# EasyEDA schematic EasyEDA_source_schematic.json
TITLE: Gluon Polarizer; REV: 1.0; Date: 2019-03-26; Sheet: 1/1; Drawn By: legomaster616; Company: Open-VX
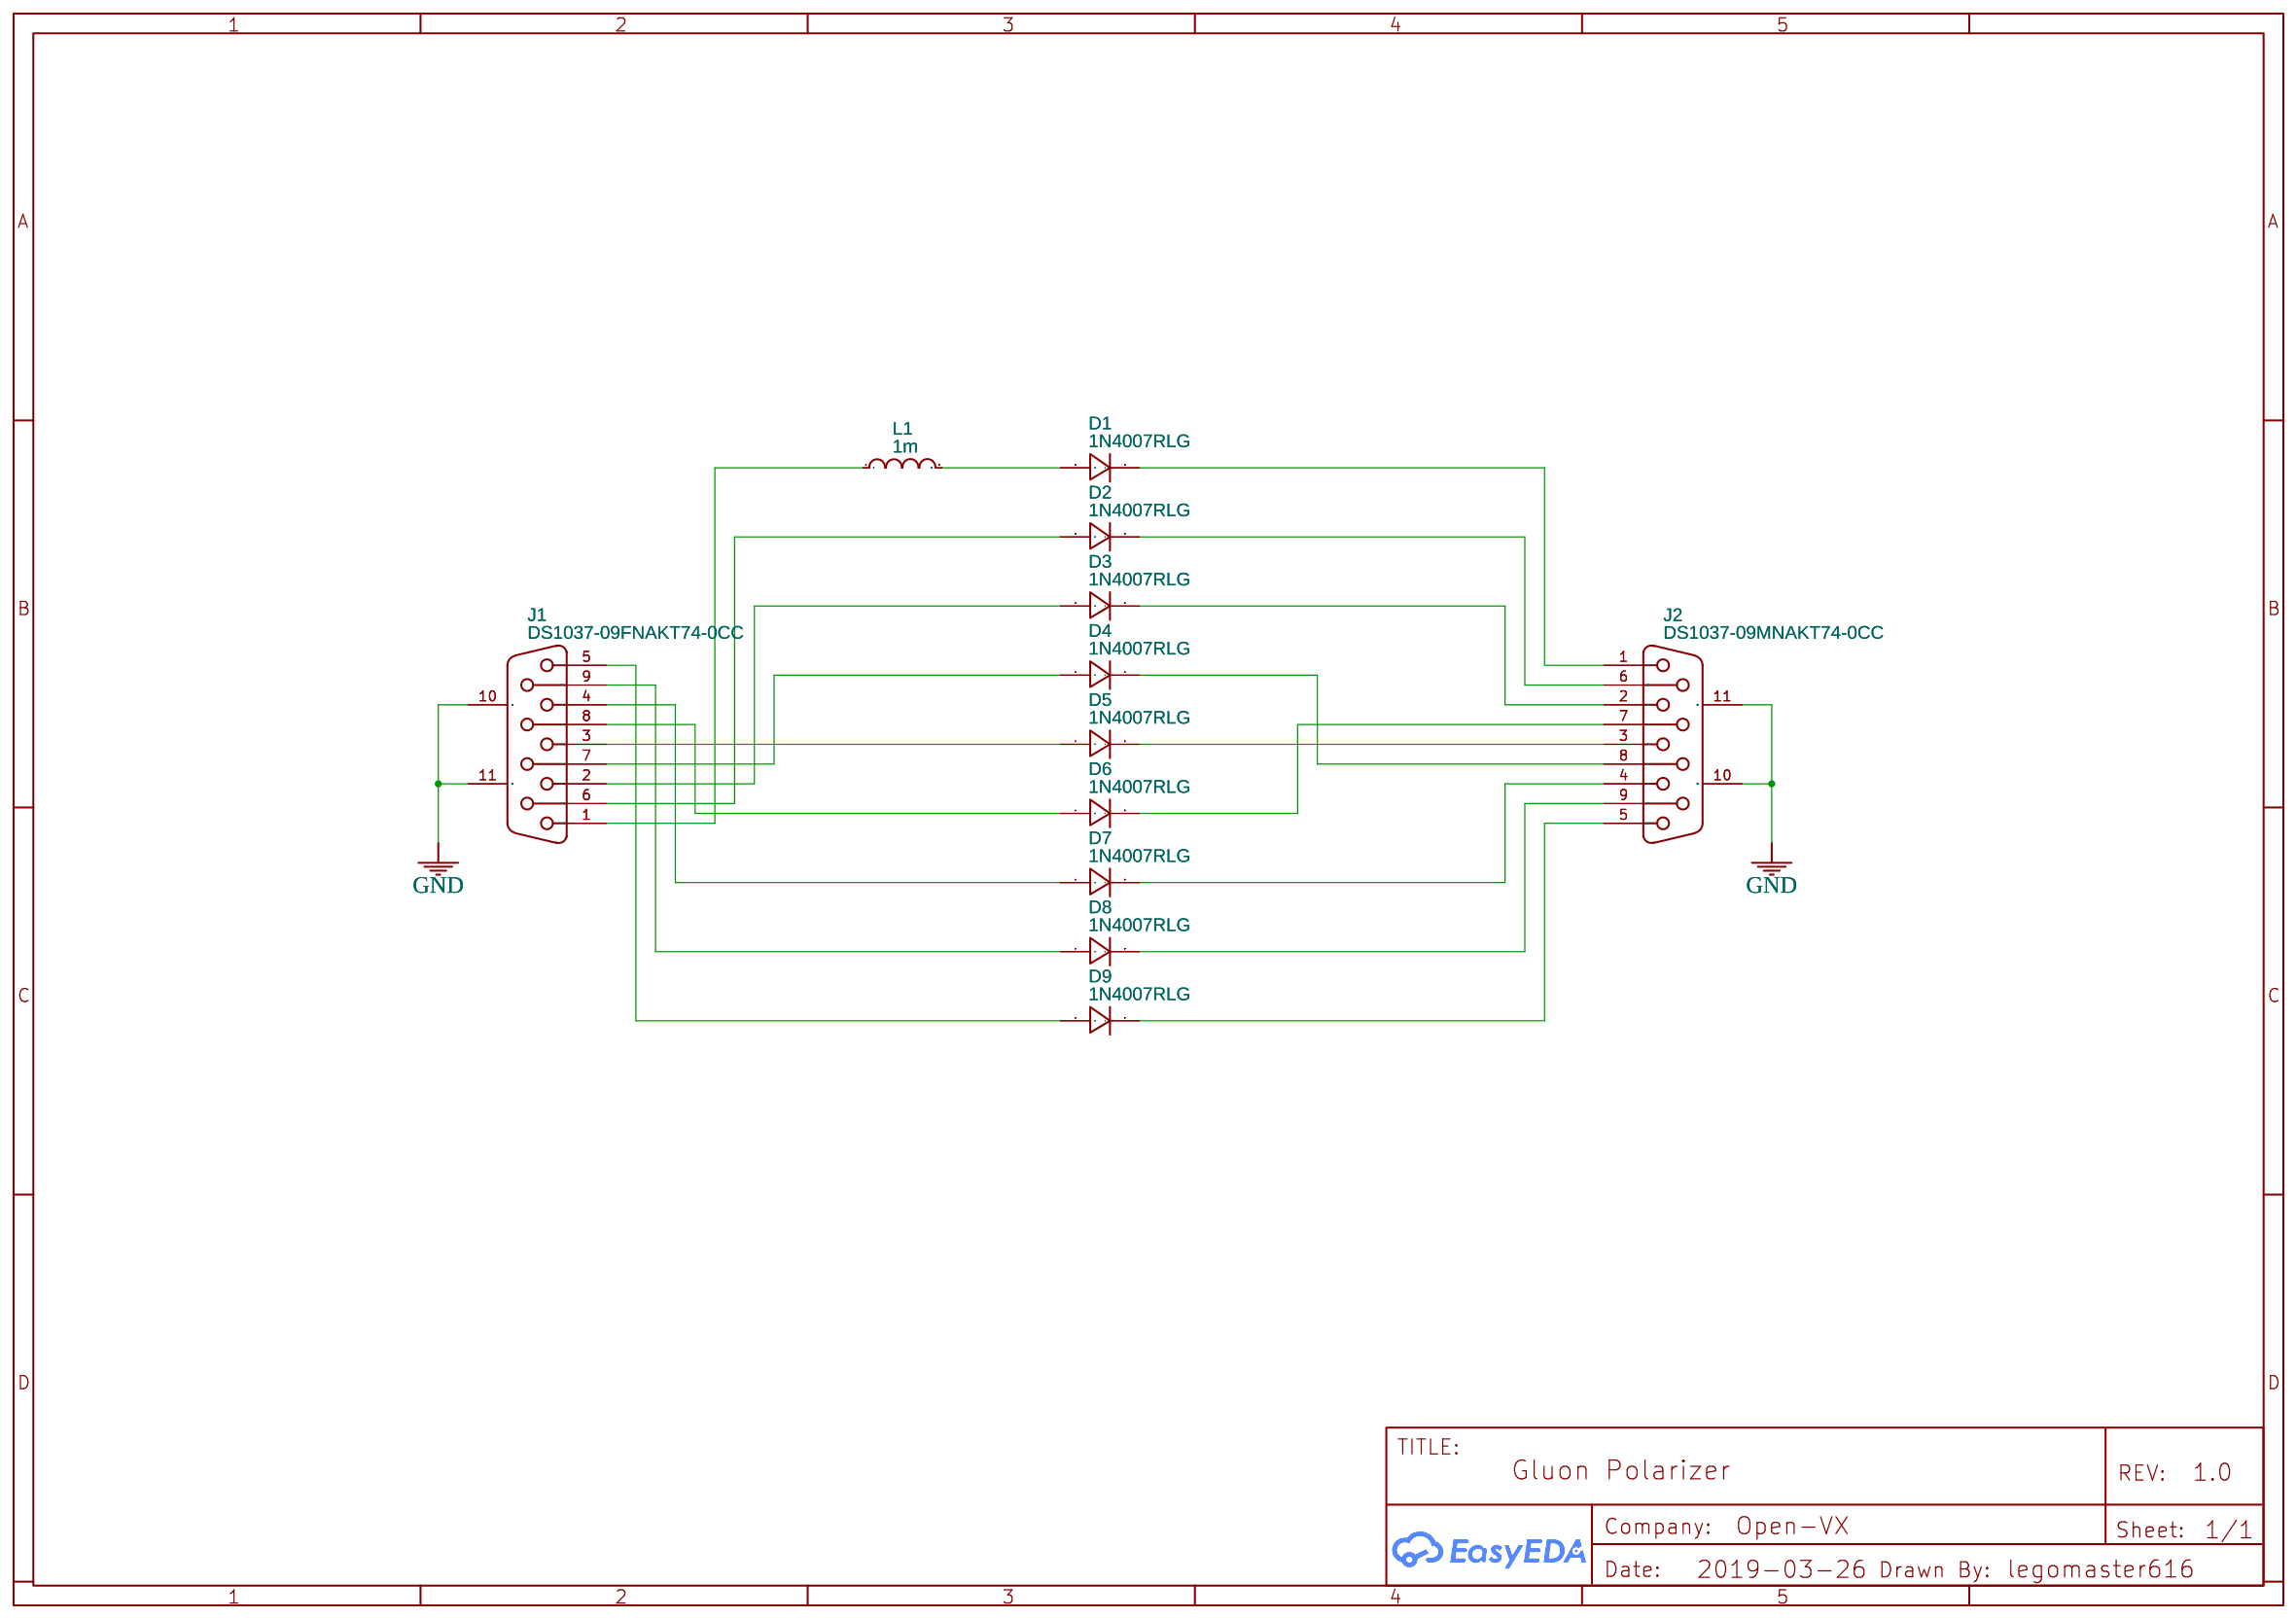
[diagram p0: schematic sheet]

## Parts
D1  1N4007RLG  [DO-41]
D2  1N4007RLG  [DO-41]
D3  1N4007RLG  [DO-41]
D4  1N4007RLG  [DO-41]
D5  1N4007RLG  [DO-41]
D6  1N4007RLG  [DO-41]
D7  1N4007RLG  [DO-41]
D8  1N4007RLG  [DO-41]
D9  1N4007RLG  [DO-41]
J1  DS1037-09FNAKT74-0CC  [DSUB9-1]
J2  DS1037-09MNAKT74-0CC  [DSUB9-1]
L1  1m  [AXIAL-0.4]

## Library data of the parts
D1-D9 = -: Supplier: LCSC; Manufacturer: ON; image: //image.lceda.cn/szlcsc/C53568.jpg; Supplier Part: C53568
J1 = -: Supplier: LCSC; Manufacturer: CONNFLY; image: //image.lceda.cn/szlcsc/C75749.jpg; Supplier Part: C75749
J2 = -: Supplier: LCSC; Manufacturer: CONNFLY; image: //image.lceda.cn/szlcsc/C75750.jpg; Supplier Part: C75750
L1 = Inductor_AXIAL-0.4_US: Manufacturer Part: ?

## Nets
GND: J1.10(MH1) J1.11(MH2) J2.10(MH1) J2.11(MH2)
D1_1: D1.1(+) L1.2
D1_2: D1.2(-) J2.1
D2_1: D2.1(+) J1.6
D2_2: D2.2(-) J2.6
D3_1: D3.1(+) J1.2
D3_2: D3.2(-) J2.2
D4_1: D4.1(+) J1.7
D4_2: D4.2(-) J2.8
D5_1: D5.1(+) J1.3
D5_2: D5.2(-) J2.3
D6_1: D6.1(+) J1.8
D6_2: D6.2(-) J2.7
D7_1: D7.1(+) J1.4
D7_2: D7.2(-) J2.4
D8_1: D8.1(+) J1.9
D8_2: D8.2(-) J2.9
D9_1: D9.1(+) J1.5
D9_2: D9.2(-) J2.5
L1_1: J1.1 L1.1
